# EAGLE design Combo miniUSB TTL v0.1 (EAGLE 6.4)
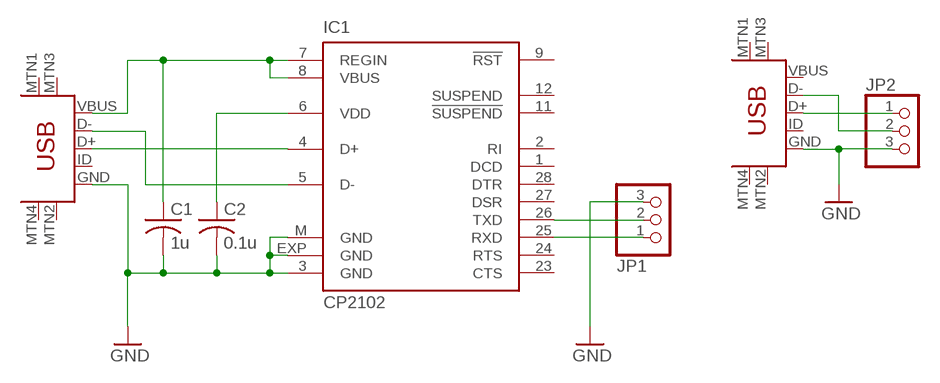
[diagram p0: schematic, sheet 1]

## Parts
C1  1u  C-USC0805  [C0805]
C2  0.1u  C-USC0805  [C0805]
IC1  CP2102  CP210X_USB_UART  [MLP28]
JP1  PINHD-1X3  [1X03]
JP2  PINHD-1X3  [1X03]
X1  USB-MINIB-5PIN  [USB-MINIB]
X2  USB-MINIB-5PIN  [USB-MINIB]

## Nets
D+: IC1.4(D+) X2.D+
D-: IC1.5(D-) X2.D-
GND: C1.2 C2.2 IC1.3(GND) IC1.EXP(GND) IC1.M(GND) JP1.3 JP2.3 X1.GND X2.GND
N$1: JP2.1 X1.D+
N$2: JP2.2 X1.D-
N$5: C2.1 IC1.6(VDD)
RXD: IC1.25(RXD) JP1.1
TXD: IC1.26(TXD) JP1.2
VBUS: C1.1 IC1.7(REGIN) IC1.8(VBUS) X2.VBUS
Unconnected: IC1.1(DCD) IC1.2(RI) IC1.9(!RST) IC1.11(!SUSPEND) IC1.12(SUSPEND) IC1.23(CTS) IC1.24(RTS) IC1.27(DSR) IC1.28(DTR) X1.ID X1.MTN1(MTN2) X1.MTN2(MTN3) X1.MTN3(MTN1) X1.MTN4 X1.VBUS X2.ID X2.MTN1(MTN2) X2.MTN2(MTN3) X2.MTN3(MTN1) X2.MTN4

## Library data of the parts
C1 C2 = adafruit:C-US: CAPACITOR, American symbol
IC1 = SparkFun-DigitalIC:CP210X_USB_UART: Single-Chip USB to UART Bridge Source: www.silabs.com .. CP2101.pdf / cp2102.pdf. Spark Fun Electronics SKU : COM-00310
JP1 JP2 = jdc:PINHD-1X3: PIN HEADER
X1 = SparkFun-Connectors:USB-MINIB: Mini-USB "B" connector with 5th pin broken out. Created new symbol breaking out 5th "ID" pin in mini/micro USB connector spec. See: http://en.wikipedia.org/wiki/Mini_usb#Cables. Uses same footprint as 4-pin symbol. Also added pins to connect to mounting / shield pads if required (probably not generally needed as signals aren't shielded once they leave the connector).
X2 = SparkFun:USB-MINIB

## Net classes
0 default: width 0.203 mm

## Board
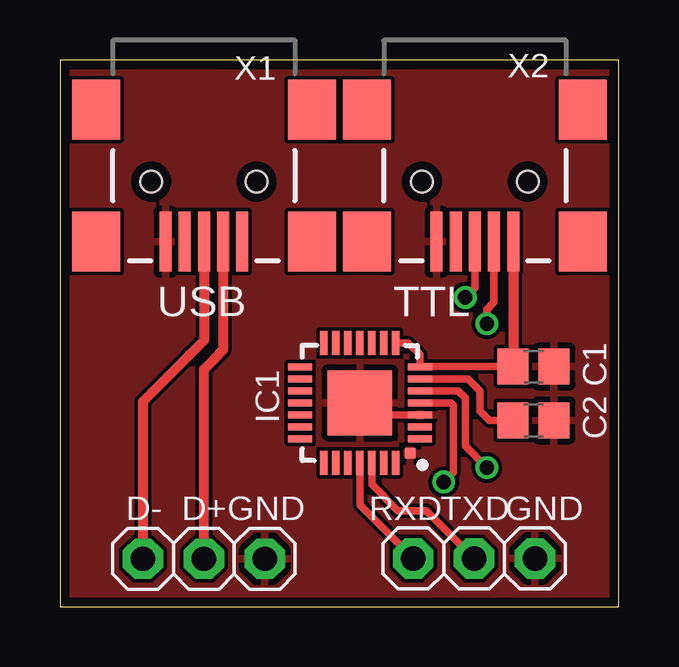
[diagram p1: board, top side]
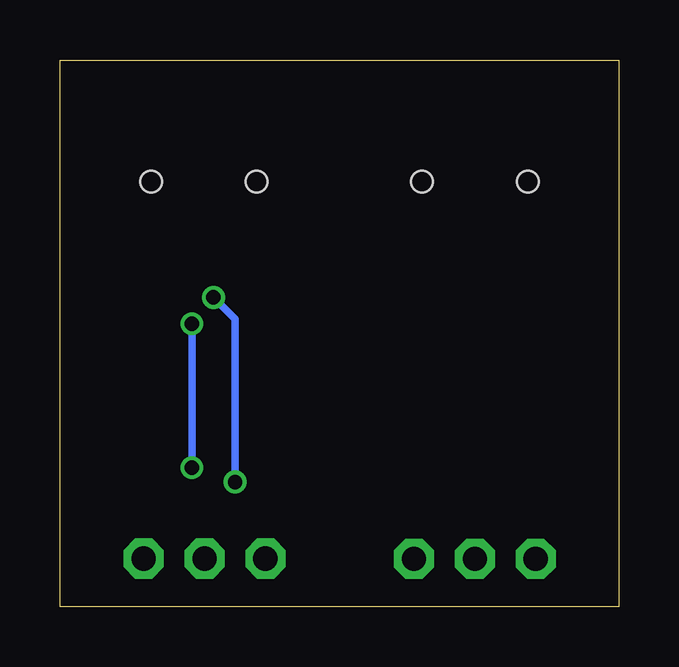
[diagram p2: board, bottom side, seen from below]

Size 23.3 x 22.8 mm. Coordinates in mm from the lower left corner, seen from the top.
Outline: 0,0 23.3,0 23.3,22.8 0,22.8 0,0
Copper layers (1*16): Top 0.0356mm / dielectric 1.5011mm / Bottom 0.0356mm
Design rules "LaenPCBOrder *": minimum track width 6mil, minimum drill 13mil, track to track 6mil, track to pad 6mil, pad to pad 6mil, via to via 6mil, smd to smd 6mil, copper to edge 15mil, drill to drill 6mil, minimum pad ring 7mil, minimum via ring 7mil, stop-mask expansion 4mil, vias tented up to drill 24mil, thermal gap 10mil

### Footprints (pad centres in the part's own frame; a part is rotated, then mirrored left to right if it is on the bottom)
C0805 = smd 1.3 x 1.5: 1 -0.85,0; 2 0.85,0
MLP28 = smd 1 x 0.3: 1 -2.5,1.5; 2 -2.5,1; 3 -2.5,0.5; 4 -2.5,0; 5 -2.5,-0.5; 6 -2.5,-1; 7 -2.5,-1.5; 15 2.5,-1.5; 16 2.5,-1; 17 2.5,-0.5; 18 2.5,0; 19 2.5,0.5; 20 2.5,1; 21 2.5,1.5 | smd 0.3 x 1: 8 -1.5,-2.5; 9 -1,-2.5; 10 -0.5,-2.5; 11 0,-2.5; 12 0.5,-2.5; 13 1,-2.5; 14 1.5,-2.5; 22 1.5,2.5; 23 1,2.5; 24 0.5,2.5; 25 0,2.5; 26 -0.5,2.5; 27 -1,2.5; 28 -1.5,2.5 | smd 2.7 x 2.7: EXP 0,0 | smd 0.435 x 0.435: M -2.103,2.103
1X03 = drill 1.016 pad 1.676 octagon: 1 -2.54,0; 2 0,0; 3 2.54,0
USB-MINIB = smd 2.5 x 0.5: D+ 2.5,0; D- 2.5,0.8; GND 2.5,-1.6; ID 2.5,-0.8; VBUS 2.5,1.6 | smd 2.5 x 2: MTN1 -3,4.5; MTN2 2.5,4.5; MTN3 -3,-4.5; MTN4 2.5,-4.5 | hole 0.9: 0,2.2; 0,-2.2

### Placement (x,y rotation side)
C1  19.74,10.01 0 top
C2  19.74,7.77 0 top
IC1  12.5,8.5 180 top
JP1  17.27,2.01 0 top
JP2  6,2 0 top
X1  6,17.72 270 top
X2  17.3,17.72 270 top

### Tracks (layer width: path | path; a pad name or v marks a point on that pad's centre or on a via)
D+  (via drill 0.6)
  Top 0.305: IC1.4 15.8,8.5 16.3,8.5 16.4,8.4 16.4,7.8 16.4,5.6 v16,5.2 | v16.9,12.9 17.3,13.3 X2.D+
  Bottom 0.305: v16,5.2 16,12 v16.9,12.9
D-  (via drill 0.6)
  Top 0.305: IC1.5 16.6,9 16.9,8.7 16.9,8 16.9,6.7 v17.8,5.8 | v17.8,11.8 17.8,12.4 18.1,12.7 X2.D-
  Bottom 0.305: v17.8,5.8 v17.8,11.8
GND
  Top 0.305: IC1.3 12.5,8 IC1.EXP
  pour Top: -0.5,23.3 24,23.3 24,-0.5 -0.5,-0.5
N$1
  Top 0.406: X1.D+ 6,11.1 5.4,10.5 3.46,8.56 JP2.1
N$2
  Top 0.406: X1.D- 6.8,10.7 6.4,10.3 6,9.9 JP2.2
N$5
  Top 0.305: IC1.6 17,9.5 17.5,9 17.5,8.17 17.9,7.77 C2.1
RXD
  Top 0.305: IC1.25 12.5,4.24 JP1.1
TXD
  Top 0.305: JP1.2 15.28,4 14.1,4 13,5.1 IC1.26
VBUS
  Top 0.305: C1.1 IC1.7 15,10.51 14.51,11 IC1.8
  Top 0.406: X2.VBUS C1.1

### Text on the board
tNames: USB | TTL | D- | D+ | GND | RXD | TXD | GND